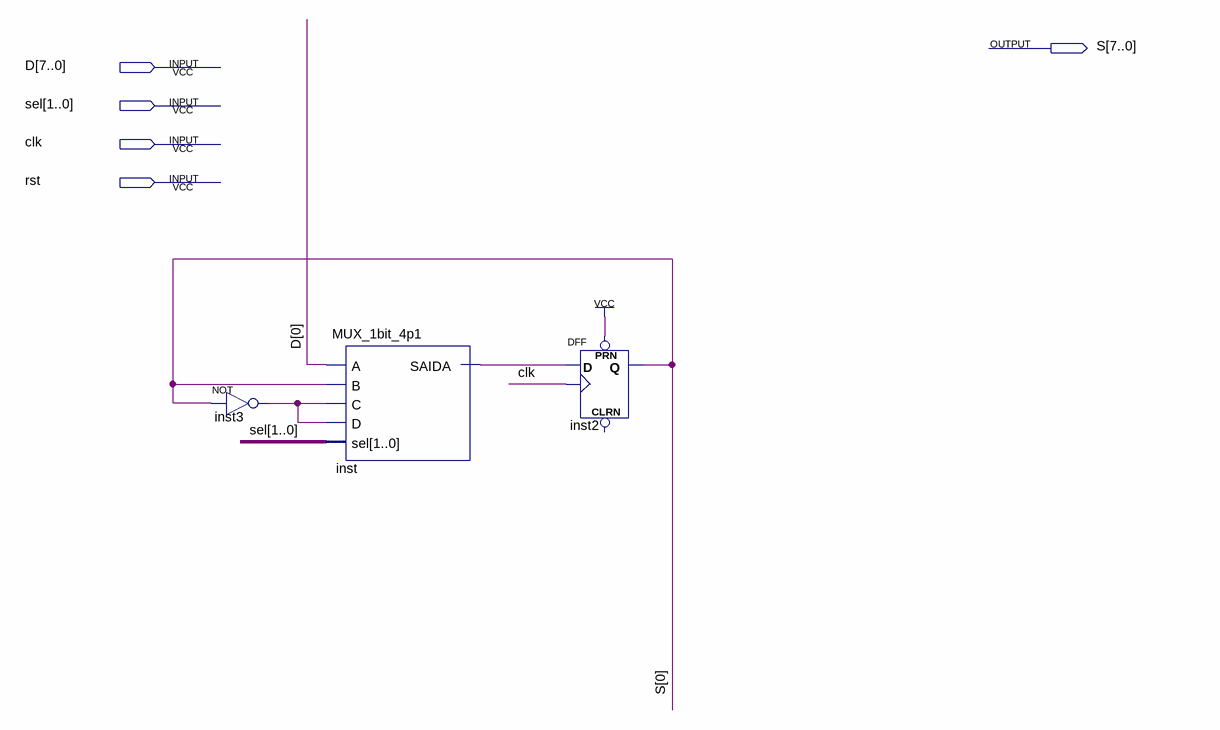
[diagram p0: schematic sheet]
// Quartus schematic PC_Ainda_nao_terminado.bdf as structural Verilog: 3 symbols, 5 pins
module PC_Ainda_nao_terminado (
  input  [7:0] D,
  input  [1:0] sel,
  input  clk,
  input  rst,
  output [7:0] S
);

  wire inst3_out, inst_saida;

  not inst3 (inst3_out, S[0]);
  MUX_1bit_4p1 inst (.A(D[0]), .B(S[0]), .C(inst3_out), .D(inst3_out), .sel(sel), .SAIDA(inst_saida));
  DFF inst2 (.CLK(clk), .D(inst_saida), .PRN(1'b1), .Q(S[0]));  // open: CLRN
endmodule
